# Altium schematic sheet TPS5430.SchDoc
size A4
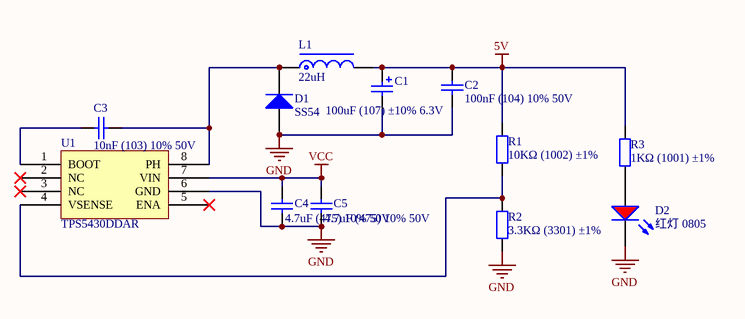
[diagram p0: TPS5430.SchDoc]

## Parts
C1  100uF (107) ±10% 6.3V  [LC-CASE-B_3528]
C2  100nF (104) 10% 50V  [LC-0603_C]
C3  10nF (103) 10% 50V  [LC-0603_C]
C4  4.7uF (475) 10% 50V  [LC-1206_C]
C5  4.7uF (475) 10% 50V  [LC-1206_C]
D1  SS54  [LC-SMA(DO-214AC)_S1]
D2  红灯 0805  [LC-0805_LED_S1]
L1  22uH  [CD54]
R1  10KΩ (1002) ±1%  [LC-0805_R]
R2  3.3KΩ (3301) ±1%  [LC-0805_R]
R3  1KΩ (1001) ±1%  [LC-0805_R]
U1  TPS5430DDAR  [LC-SOP-8_EP_150mil]

## Nets
5V: C1.1 C2.2 L1.2 R1.2 R3.2
GND: C1.2 C2.1 C4.1 C5.1 D1.1(A) D2.K R2.1 U1.6(GND)
VCC: C4.2 C5.2 U1.7(VIN)
NetC3_1: C3.1 U1.1(BOOT)
NetC3_2: C3.2 D1.2(K) L1.1 U1.8(PH)
NetD2_A: D2.A R3.1
NetR1_1: R1.1 R2.2 U1.4(VSENSE)

Not connected (* = marked no-connect by the designer): U1 2(NC)* 3(NC)* 5(ENA)*

## Library data of the parts
C1 = 3528 100uF (107) 10% 6.3V: 钽电容; ComponentLink1Description: 供应商链接; ComponentLink1URL: http://www.szlcsc.com/product/details_16815.html; Package: 3528; Supplier: LC; SuppliersPartNumber: C16133
C2 = 0603 100nF (104) 10% 50V: 贴片电容; ComponentLink1Description: 供应商链接; ComponentLink1URL: http://www.szlcsc.com/product/details_15331.html; Package: 0603; Supplier: LC; SuppliersPartNumber: C14663
C3 = 0603 10nF (103) 10% 50V: 贴片电容; ComponentLink1Description: 供应商链接; ComponentLink1URL: http://www.szlcsc.com/product/details_58143.html; Package: 0603; Supplier: LC; SuppliersPartNumber: C57112
C4 C5 = 1206 4.7uF (475) 10% 50V: 贴片电容; ComponentLink1Description: 供应商链接; ComponentLink1URL: http://www.szlcsc.com/product/details_30577.html; Package: 1206; Supplier: LC; SuppliersPartNumber: C29823
D1 = SMA(DO-214AC) SS54: 二极管; ComponentLink1Description: 供应商链接; ComponentLink1URL: http://www.szlcsc.com/product/details_23178.html; Package: SMA(DO-214AC); Supplier: LC; SuppliersPartNumber: C22452
D2 = 0805 红灯: 发光二极管; ComponentLink1Description: 供应商链接; ComponentLink1URL: http://www.szlcsc.com/product/details_2668.html; Package: 0805; Supplier: LC; SuppliersPartNumber: C2295
L1 = L-CD: 贴片功率电感; BOM名称: 功率电感; 版权归属: 源创客; 学习资源: www.ooocke.com
R1 = 0805 10KΩ (1002) 1%: 贴片电阻; ComponentLink1Description: 供应商链接; ComponentLink1URL: http://www.szlcsc.com/product/details_18102.html; Package: 0805; Supplier: LC; SuppliersPartNumber: C17414
R2 = 0805 3.3KΩ (3301) 1%: 贴片电阻; ComponentLink1Description: 供应商链接; ComponentLink1URL: http://www.szlcsc.com/product/details_26753.html; Package: 0805; Supplier: LC; SuppliersPartNumber: C26010
R3 = 0805 1KΩ (1001) 1%: 贴片电阻; ComponentLink1Description: 供应商链接; ComponentLink1URL: http://www.szlcsc.com/product/details_18201.html; Package: 0805; Supplier: LC; SuppliersPartNumber: C17513
U1 = TPS5430DDAR: DC-DC芯片; ComponentLink1Description: 供应商链接; ComponentLink1URL: http://www.szlcsc.com/product/details_10396.html; Package: SOP-8_EP_150mil; Supplier: LC; SuppliersPartNumber: C9864